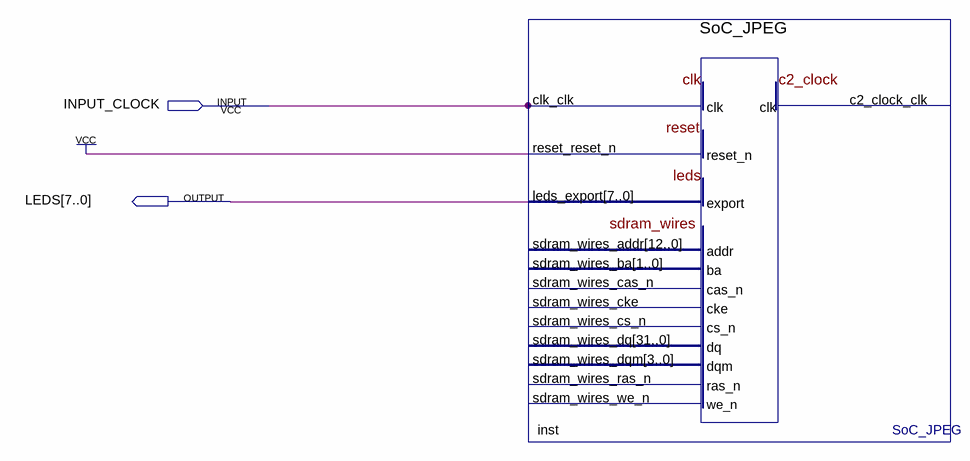
[diagram p0: schematic sheet]
// Quartus schematic TopLevel.bdf as structural Verilog: 1 symbols, 2 pins
module TopLevel (
  input  INPUT_CLOCK,
  output [7:0] LEDS
);

  SoC_JPEG inst (
    .clk_clk(INPUT_CLOCK), .reset_reset_n(1'b1), .leds_export(LEDS));  // open: sdram_wires_addr, sdram_wires_ba, sdram_wires_cas_n, sdram_wires_cke, sdram_wires_cs_n, sdram_wires_dqm, sdram_wires_ras_n, sdram_wires_we_n, c2_clock_clk, sdram_wires_dq
endmodule
